# Altium schematic sheet TPaletteWindow.schDOC: LiveDesign Evaluation - Video Windows
size A4; Organization: Altium Limited; Address1: L3, 12a Rodborough Rd; Address2: Frenchs Forest; Address3: NSW; Address4: Australia 2086; DocumentNumber: 14; SheetNumber: 14; SheetTotal: 20
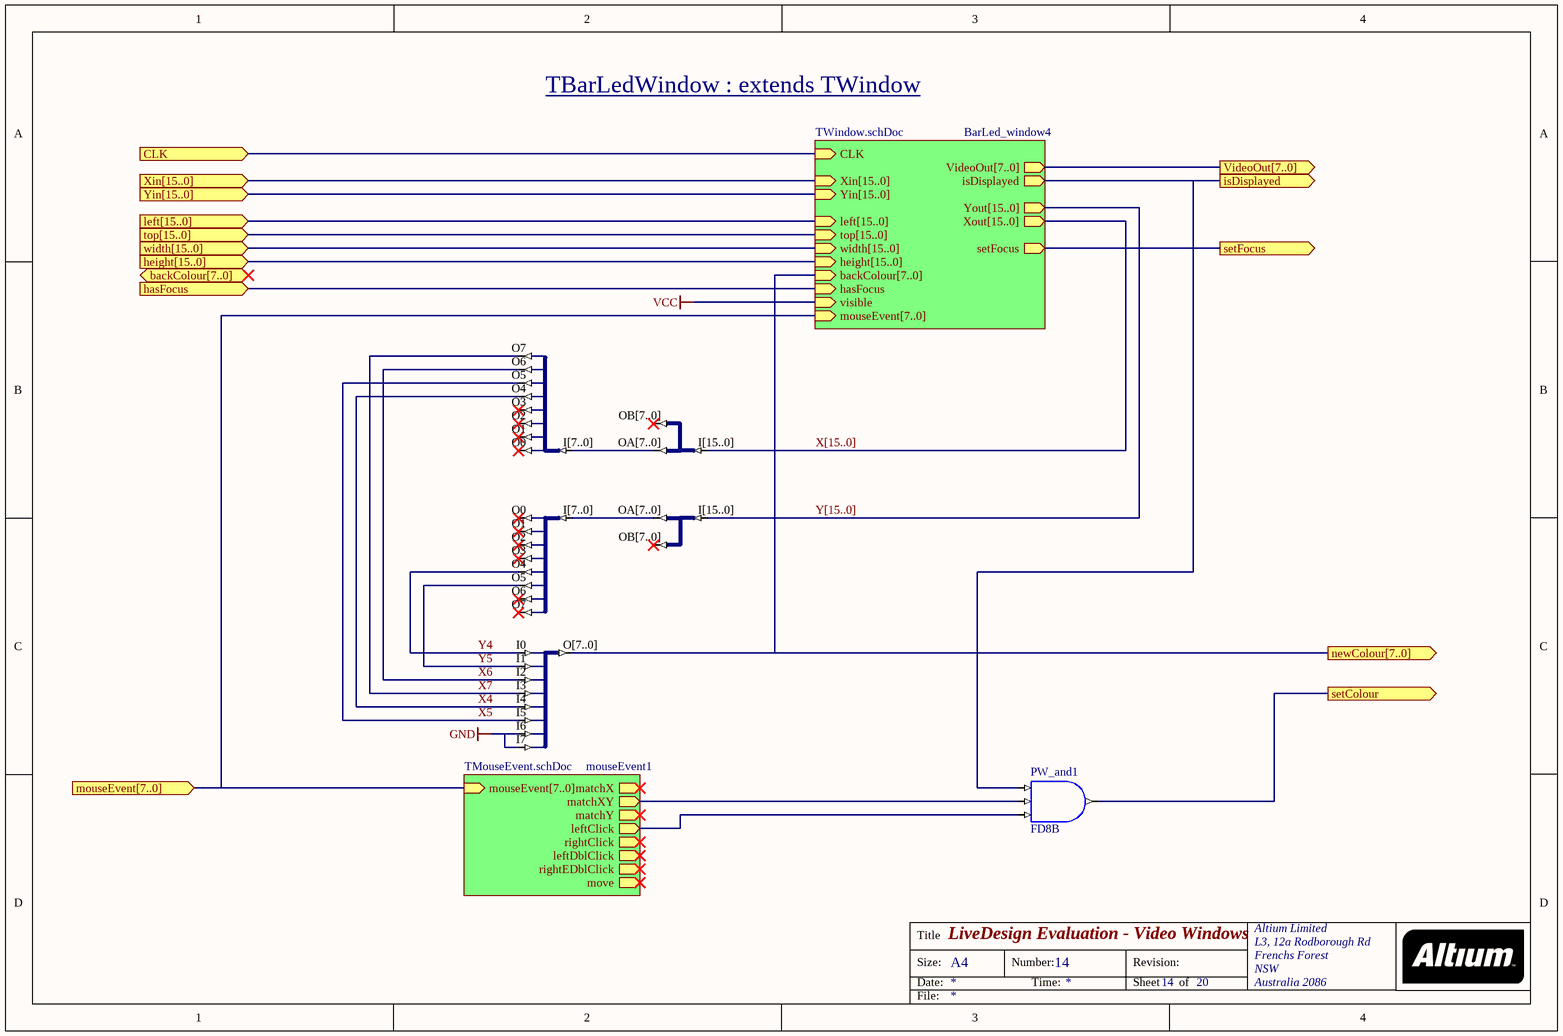
[diagram p0: TPaletteWindow.schDOC]

## Parts
PW_and1  FD8B
U12  J8S_8B  (value not drawn)
U13  J16B_8B2  (value not drawn)
U14  J16B_8B2  (value not drawn)
U15  J8B_8S  (value not drawn)
U16  J8B_8S  (value not drawn)

## Sub-sheets
BarLed_window4 = TWindow.schDoc: CLK (in), VideoOut[7..0] (out), Xin[15..0] (in), Yin[15..0] (in), top[15..0] (in), width[15..0] (in), height[15..0] (in), left[15..0] (in), Xout[15..0] (out), Yout[15..0] (out), backColour[7..0] (in), isDisplayed (out), visible (in), hasFocus (in), mouseEvent[7..0] (in), setFocus (out)
mouseEvent1 = TMouseEvent.schDoc: mouseEvent[7..0] (in), matchX (out), matchXY (out), matchY (out), leftClick (out), rightClick (out), leftDblClick (out), rightEDblClick (out), move (out)

## Ports
backColour[7..0] (in), CLK (in), hasFocus (in), height[15..0] (in), isDisplayed (out), left[15..0] (in), mouseEvent[7..0] (in), newColour[7..0] (out), setColour (out), setFocus (out), top[15..0] (in), VideoOut[7..0] (out), width[15..0] (in), Xin[15..0] (in), Yin[15..0] (in)

## Nets
GND: U12.I6 U12.I7
VCC: sheet BarLed_window4/visible
CLK: port CLK, sheet BarLed_window4/CLK
hasFocus: port hasFocus, sheet BarLed_window4/hasFocus
isDisplayed: PW_and1.I0 ; port isDisplayed, sheet BarLed_window4/isDisplayed
newColour[7..0]: U12.O[7..0] ; port newColour[7..0], sheet BarLed_window4/backColour[7..0]
setColour: PW_and1.O ; port setColour
setFocus: port setFocus, sheet BarLed_window4/setFocus
X4: U12.I4 U15.O4
X5: U12.I5 U15.O5
X6: U12.I2 U15.O6
X7: U12.I3 U15.O7
X[15..0]: U13.I[15..0] ; sheet BarLed_window4/Xout[15..0]
Y4: U12.I0 U16.O4
Y5: U12.I1 U16.O5
Y[15..0]: U14.I[15..0] ; sheet BarLed_window4/Yout[15..0]
NetPW_and1_I1: PW_and1.I1 ; sheet mouseEvent1/matchXY
NetPW_and1_I2: PW_and1.I2 ; sheet mouseEvent1/leftClick
NetU13_OA[7..0]: U13.OA[7..0] U15.I[7..0]
NetU14_OA[7..0]: U14.OA[7..0] U16.I[7..0]

Not connected (* = marked no-connect by the designer): U13 OB[7..0]*; U14 OB[7..0]*; U15 O0* O1* O2* O3*; U16 O0* O1* O2* O3* O6* O7*

## Buses and harness runs
bus port height[15..0] = sheet BarLed_window4/height[15..0]
bus port left[15..0] = sheet BarLed_window4/left[15..0]
bus port mouseEvent[7..0] = sheet BarLed_window4/mouseEvent[7..0] = sheet mouseEvent1/mouseEvent[7..0]
bus port newColour[7..0] = sheet BarLed_window4/backColour[7..0]
bus port top[15..0] = sheet BarLed_window4/top[15..0]
bus port VideoOut[7..0] = sheet BarLed_window4/VideoOut[7..0]
bus port width[15..0] = sheet BarLed_window4/width[15..0]
bus port Xin[15..0] = sheet BarLed_window4/Xin[15..0]
bus port Yin[15..0] = sheet BarLed_window4/Yin[15..0]
bus X[15..0] = sheet BarLed_window4/Xout[15..0]
bus Y[15..0] = sheet BarLed_window4/Yout[15..0]

## Notes on the sheet
- TBarLedWindow : extends TWindow
- Title
- Size:
- Date:
- A4
- Number:
- Time:
- Revision:
- Sheet
- of
- File:

## Library data of the parts
PW_and1 = AND3S: 3-Input AND Gate, Single Pin Version; Xilinx Equivalent: AND3; ArchiveName: GENERIC; Published: 9-30-2003; Publisher: Altium Limited; Core Revision: 1.00.00
U12 = J8S_8B: 8 Single pin inputs to single 8-Bit output bus; ArchiveName: GENERIC; VHDLIB_SIM: GENERIC_LIB; Published: 29-Jan-2004; Publisher: Altium Limited; Core Revision: 1.00.00
U13 U14 = J16B_8B2: 1 x 16-bit input bus to 2 x 8-Bit output bus; ArchiveName: GENERIC; VHDLIB_SIM: GENERIC_LIB; Published: 29-Jan-2004; Publisher: Altium Limited; Core Revision: 1.00.00
U15 U16 = J8B_8S: 8-Bit input bus to 8 single pin outputs; ArchiveName: GENERIC; VHDLIB_SIM: GENERIC_LIB; Published: 29-Jan-2004; Publisher: Altium Limited; Core Revision: 1.00.00